# Altium schematic sheet bridge.SchDoc
size 431 x 279 mm; SheetNumber: 1; SheetTotal: 9
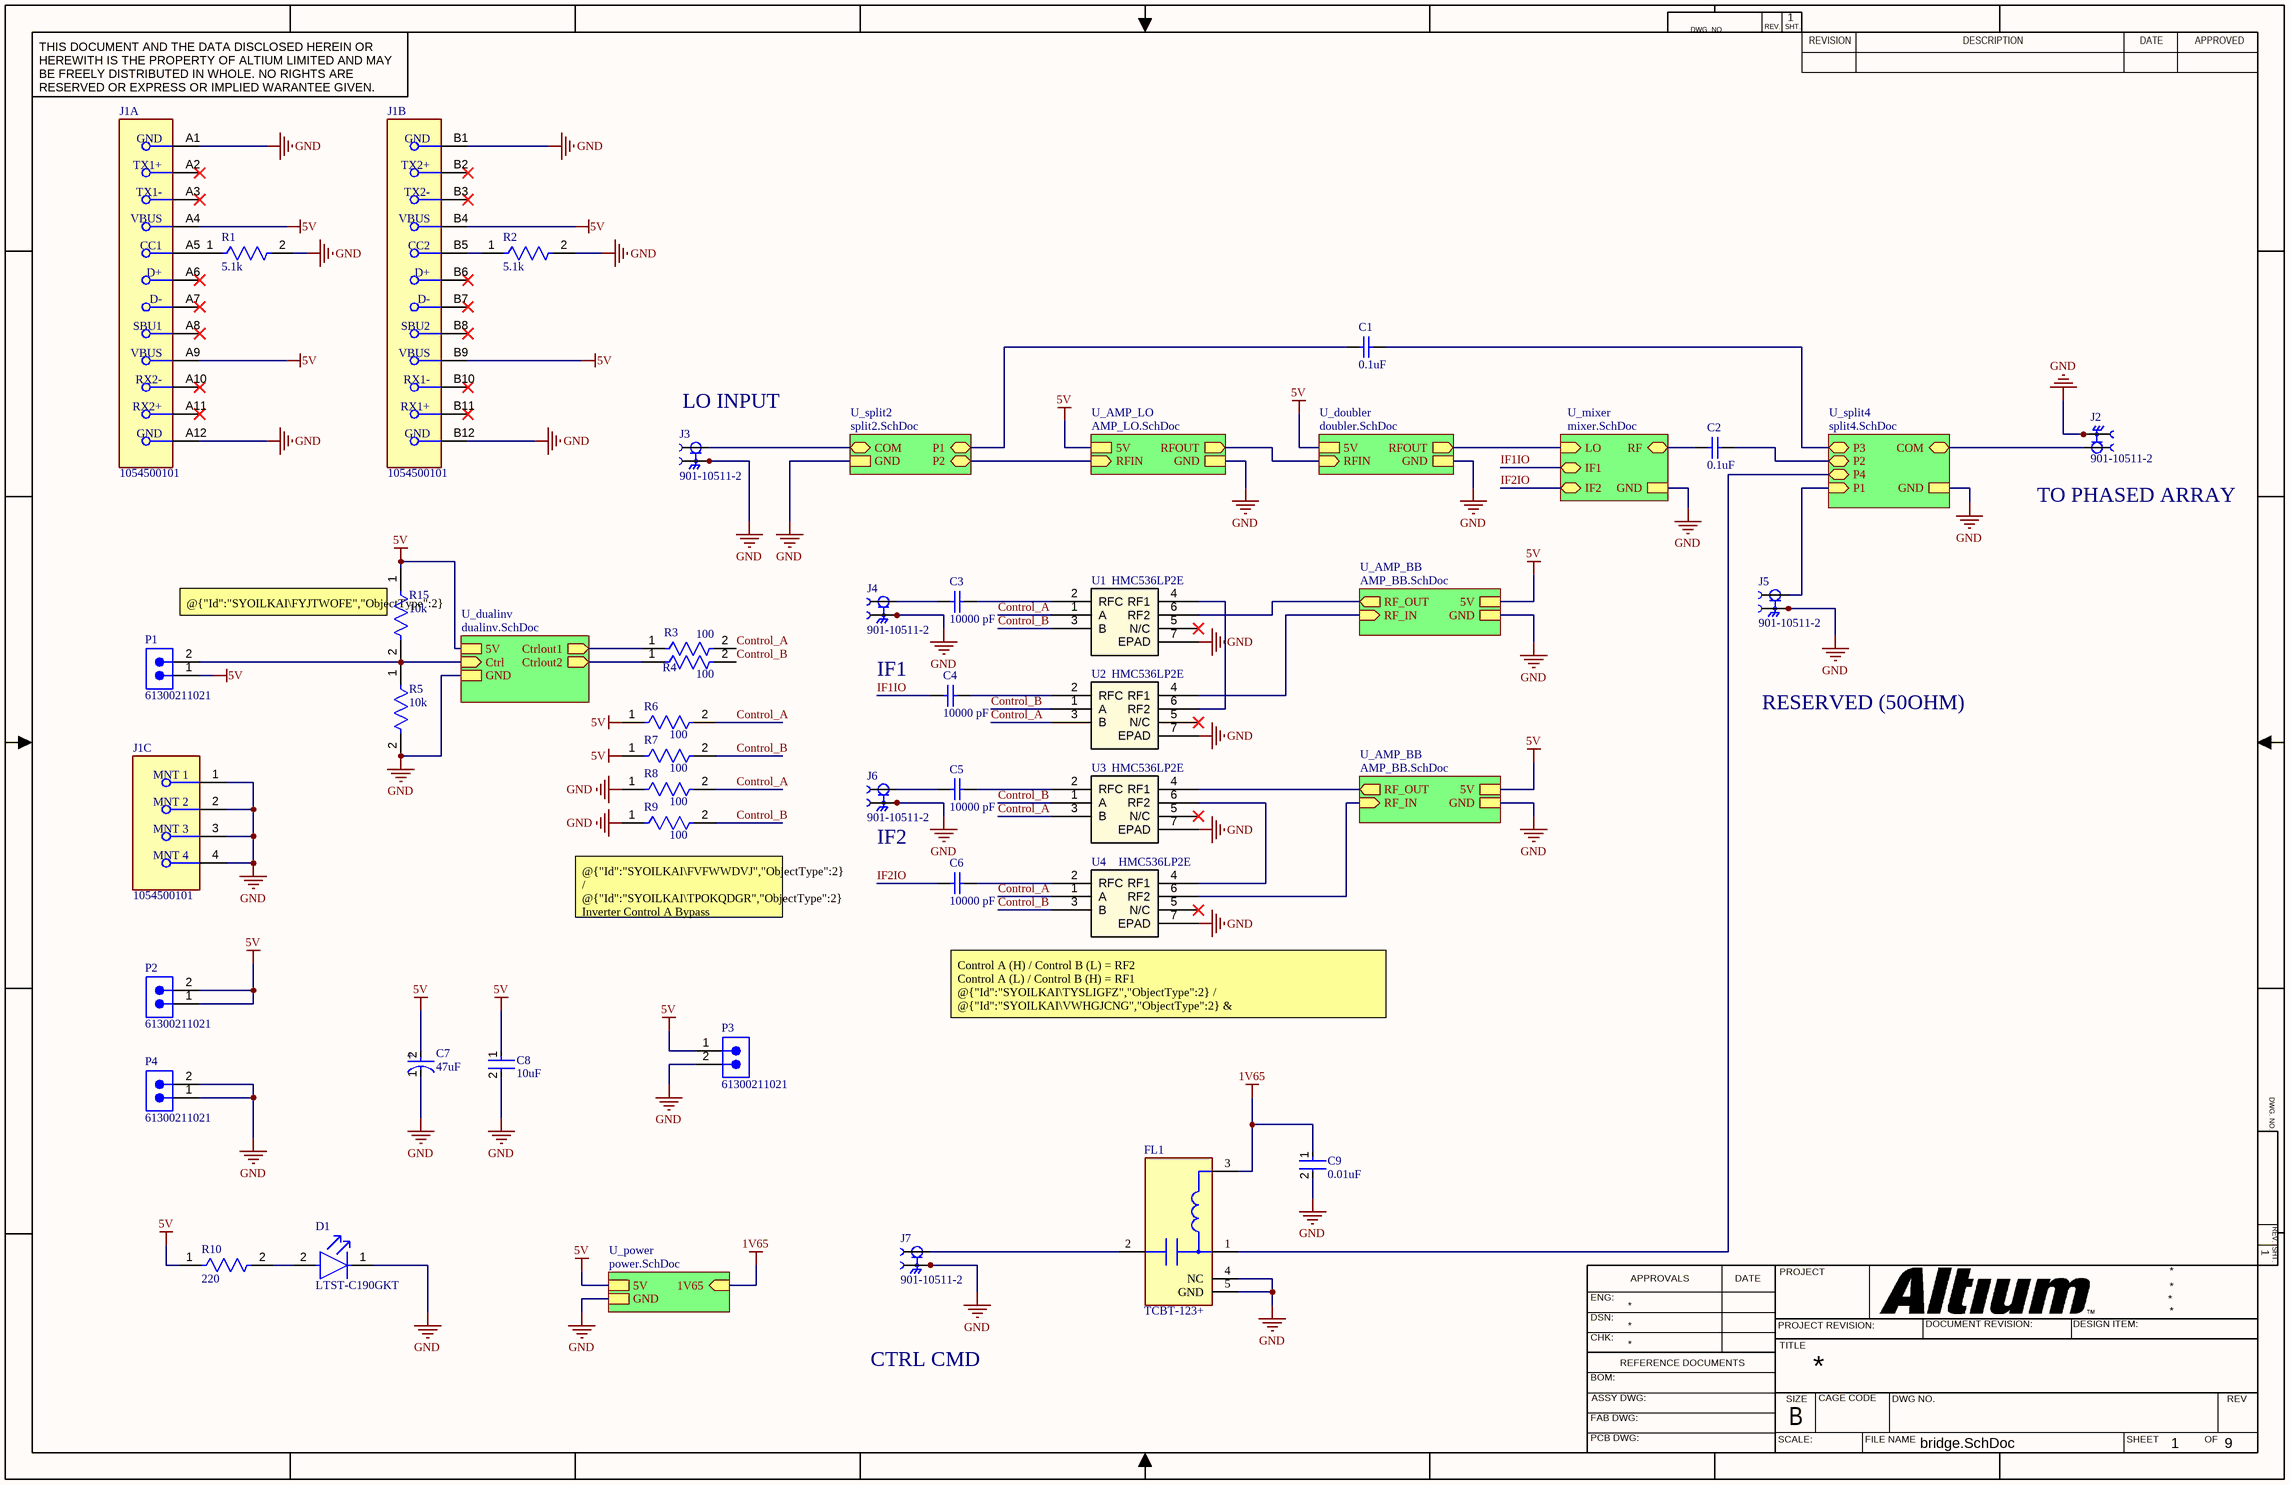
[diagram p0: bridge.SchDoc]

## Parts
C1  0.1uF  [CAPC0603X33X15LL03T05]
C2  0.1uF  [CAPC0603X33X15LL03T05]
C3  10000 pF  [CAPC1005X55X25ML05T10]
C4  10000 pF  [CAPC1005X55X25ML05T10]
C5  10000 pF  [CAPC1005X55X25ML05T10]
C6  10000 pF  [CAPC1005X55X25ML05T10]
C7  47uF  [FP-TAJB-MFG]
C8  10uF  [FP-ZRB18AR61E106ME01L-MFG]
C9  0.01uF  [FP-C0402-BB-MFG]
D1  LTST-C190GKT  [FP-LTST-C190GKT-MFG]
FL1  TCBT-123+  [FP-GU1414-MFG]
J1  1054500101  [FP-1054500101-MFG]  (parts A,B,C of 3)
J2  901-10511-2  [AMPHENOL_901-10511-2]
J3  901-10511-2  [AMPHENOL_901-10511-2]
J4  901-10511-2  [AMPHENOL_901-10511-2]
J5  901-10511-2  [AMPHENOL_901-10511-2]
J6  901-10511-2  [AMPHENOL_901-10511-2]
J7  901-10511-2  [AMPHENOL_901-10511-2]
P1  61300211021  [61300211021]
P2  61300211021  [61300211021]
P3  61300211021  [61300211021]
P4  61300211021  [61300211021]
R1  5.1k  [FP-CRCW0603-e3-IPC_C]
R2  5.1k  [FP-CRCW0603-e3-IPC_C]
R3  100  [FP-RC0603-0_55-MFG]
R4  100  [FP-RC0603-0_55-MFG]
R5  10k  [FP-RC0603-0_55-IPC_C]
R6  100  [FP-RC0603-0_55-MFG]
R7  100  [FP-RC0603-0_55-MFG]
R8  100  [FP-RC0603-0_55-MFG]
R9  100  [FP-RC0603-0_55-MFG]
R10  220  [FP-ERJ3G-MFG]
R15  10k  [FP-RC0603-0_55-IPC_C]
U1  HMC536LP2E  [HMC536LP2E]
U2  HMC536LP2E  [HMC536LP2E]
U3  HMC536LP2E  [HMC536LP2E]
U4  HMC536LP2E  [HMC536LP2E]

## Sub-sheets
U_AMP_BB = AMP_BB.SchDoc: RF_OUT (out), RF_IN (in), 5V, GND
U_AMP_BB = AMP_BB.SchDoc: RF_OUT (out), RF_IN (in), 5V, GND
U_AMP_LO = AMP_LO.SchDoc: GND, 5V, RFIN (in), RFOUT (out)
U_doubler = doubler.SchDoc: RFOUT (out), RFIN (in), GND, 5V
U_dualinv = dualinv.SchDoc: Ctrl (in), 5V, GND, Ctrlout1 (out), Ctrlout2 (out)
U_mixer = mixer.SchDoc: RF (bidir), GND, LO (in), IF1 (bidir), IF2 (bidir)
U_power = power.SchDoc: 5V, GND, 1V65 (in)
U_split2 = split2.SchDoc: COM (bidir), P1 (bidir), P2 (bidir), GND
U_split4 = split4.SchDoc: GND, P1 (in), P2 (bidir), P3 (bidir), P4 (bidir), COM (bidir)

## Nets
1V65: C9.1 FL1.3(DC) ; sheet U_power/1V65
5V: C7.2(A) C8.1 J1.A4(VBUS) J1.A9(VBUS) J1.B4(VBUS) J1.B9(VBUS) P1.1 P2.1 P2.2 P3.1 R6.1 R7.1 R10.1 R15.1 ; sheet U_AMP_LO/5V, sheet U_doubler/5V, sheet U_power/5V, sheet U_dualinv/5V, sheet U_AMP_BB/5V, sheet U_AMP_BB/5V
GND: C7.1(C) C8.2 C9.2 D1.1(C) FL1.4(NC) FL1.5(GND) J1.1(MNT_1) J1.2(MNT_2) J1.3(MNT_3) J1.4(MNT_4) J1.A1(GND) J1.A12(GND) J1.B1(GND) J1.B12(GND) J2.G1 J2.G2 J3.G1 J3.G2 J4.G1 J4.G2 J5.G1 J5.G2 J6.G1 J6.G2 J7.G1 J7.G2 P3.2 P4.1 P4.2 R1.2 R2.2 R5.2 R8.1 R9.1 U1.7(EPAD) U2.7(EPAD) U3.7(EPAD) U4.7(EPAD) ; sheet U_split2/GND, sheet U_mixer/GND, sheet U_split4/GND, sheet U_AMP_LO/GND, sheet U_doubler/GND, sheet U_power/GND, sheet U_dualinv/GND, sheet U_AMP_BB/GND, sheet U_AMP_BB/GND
Control_A: R3.2 R6.2 R8.2 U1.1(A) U2.3(B) U3.3(B) U4.1(A)
Control_B: R4.2 R7.2 R9.2 U1.3(B) U2.1(A) U3.1(A) U4.3(B)
IF1IO: C4.1 ; sheet U_mixer/IF1
IF2IO: C6.1 ; sheet U_mixer/IF2
NetC1_1: C1.1 ; sheet U_split2/P1
NetC1_2: C1.2 ; sheet U_split4/P3
NetC2_1: C2.1 ; sheet U_mixer/RF
NetC2_2: C2.2 ; sheet U_split4/P2
NetC3_1: C3.1 J4.1
NetC3_2: C3.2 U1.2(RFC)
NetC4_2: C4.2 U2.2(RFC)
NetC5_1: C5.1 J6.1
NetC5_2: C5.2 U3.2(RFC)
NetC6_2: C6.2 U4.2(RFC)
NetD1_2: D1.2(A) R10.2
NetFL1_1: FL1.1(RF&DC) ; sheet U_split4/P4
NetFL1_2: FL1.2(RF) J7.1
NetJ1_A5: J1.A5(CC1) R1.1
NetJ1_B5: J1.B5(CC2) R2.1
NetJ2_1: J2.1 ; sheet U_split4/COM
NetJ3_1: J3.1 ; sheet U_split2/COM
NetJ5_1: J5.1 ; sheet U_split4/P1
NetP1_2: P1.2 R5.1 R15.2 ; sheet U_dualinv/Ctrl
NetR3_1: R3.1 ; sheet U_dualinv/Ctrlout1
NetR4_1: R4.1 ; sheet U_dualinv/Ctrlout2
NetU1_4: U1.4(RF1) U2.6(RF2)
NetU1_6: U1.6(RF2) ; sheet U_AMP_BB/RF_OUT
NetU2_4: U2.4(RF1) ; sheet U_AMP_BB/RF_IN
NetU3_4: U3.4(RF1) ; sheet U_AMP_BB/RF_OUT
NetU3_6: U3.6(RF2) U4.4(RF1)
NetU4_6: U4.6(RF2) ; sheet U_AMP_BB/RF_IN
(unnamed): sheet U_split2/P2, sheet U_AMP_LO/RFIN
(unnamed): sheet U_mixer/LO, sheet U_doubler/RFOUT
(unnamed): sheet U_AMP_LO/RFOUT, sheet U_doubler/RFIN

Not connected (* = marked no-connect by the designer): J1 A2(TX1+)* A3(TX1-)* A6(D+)* A7(D-)* A8(SBU1)* A10(RX2-)* A11(RX2+)* B2(TX2+)* B3(TX2-)* B6(D+)* B7(D-)* B8(SBU2)* B10(RX1-)* B11(RX1+)*; U1 5(N/C)*; U2 5(N/C)*; U3 5(N/C)*; U4 5(N/C)*

## Notes on the sheet
- (near J3) LO INPUT
- (near J2) TO PHASED ARRAY
- (near R15) @{"Id":"SYOILKAI\FYJTWOFE","ObjectType":2} Pull-up DNI (Either @{"Id":"SYOILKAI\FYJTWOFE","ObjectType":2} | @{"Id":"SYOILKAI\KEMWNYXD","ObjectType":2} )
- IF1
- RESERVED (50OHM)
- (near J6) IF2
- (near R9) @{"Id":"SYOILKAI\FVFWWDVJ","ObjectType":2} / @{"Id":"SYOILKAI\TPOKQDGR","ObjectType":2} Inverter Control A Bypass
  @{"Id":"SYOILKAI\AHJBANLV","ObjectType":2} / @{"Id":"SYOILKAI\UMPLHLDU","ObjectType":2} Inverter Control B Bypass
  DNI Components.   Remove @{"Id":"SYOILKAI\ASZVIMTH","ObjectType":2} / @{"Id":"SYOILKAI\MEZSTMKU","ObjectType":2} to bypass
- (near U4) Control A (H) / Control B (L) = RF2
  Control A (L) / Control B (H) = RF1
  @{"Id":"SYOILKAI\TYSLIGFZ","ObjectType":2} / @{"Id":"SYOILKAI\VWHGJCNG","ObjectType":2} & @{"Id":"SYOILKAI\SXPUWDCE","ObjectType":2} / @{"Id":"SYOILKAI\PSJWTDBZ","ObjectType":2} Ctrl (L) --> Control A (H) / Control B (L) = AMP
  @{"Id":"SYOILKAI\TYSLIGFZ","ObjectType":2} / @{"Id":"SYOILKAI\VWHGJCNG","ObjectType":2} & @{"Id":"SYOILKAI\SXPUWDCE","ObjectType":2} / @{"Id":"SYOILKAI\PSJWTDBZ","ObjectType":2} Ctrl (H) --> Control A (L) / Control B (H) = Bypass
- CTRL CMD
- DWG. NO.
- REV.
- SHT.
- THIS DOCUMENT AND THE DATA DISCLOSED HEREIN OR HEREWITH IS THE PROPERTY OF ALTIUM LIMITED AND MAY BE FREELY DISTRIBUTED IN WHOLE. NO RIGHTS ARE RESERVED OR EXPRESS OR IMPLIED WARANTEE GIVEN.
- REVISION
- DESCRIPTION
- DATE
- APPROVED
- ENG:
- APPROVALS
- PROJECT
- DSN:
- CHK:
- REFERENCE DOCUMENTS
- PROJECT REVISION:
- TITLE
- DOCUMENT REVISION:
- DESIGN ITEM:
- BOM:
- FAB DWG:
- PCB DWG:
- ASSY DWG:
- SCALE:
- SIZE
- B
- CAGE CODE
- FILE NAME
- DWG NO.
- SHEET
- OF
- REV
- (in symbol CMP-04424-000629-1) +

## Library data of the parts
C1 C2 = CMP-2010-00245-1: CAP CER 0.1UF 16V X5R 0201, Broadband / Multilayer Capacitor; Manufacturer: KYOCERA AVX; Part Number: 531Z104KT16T; Supplier 1: Mouser; Supplier Part Number 1: 581-531Z104KT16T
C3-C6 = CNP-CAP-10000PF-RF: CAP CER 10000PF 16V X7R 0402, RF Series; Manufacturer: KYOCERA AVX; Part Number: 520L103KT16T; Supplier 1: Mouser; Supplier Part Number 1: 81-RDER72H473K2K1H3B
C7 = CMP-04424-000629-1: 47uF 10V  ±10% 1Ω 1210  SMD Tantalum Capacitor; Part Number: TAJB476K010RNJ; Manufacturer: KYOCERA AVX; Leakage Current: 4.7uA; ESR (Equivalent Series Resistance): 1R; Dissipation Factor: 8%; Polarity: Polar; Package Quantity: 1; Length: 3.5mm; Dielectric Material: Tantalum; Series: TAJ; Termination: SMD/SMT; Case Code (Metric): 3528; Case Code (Imperial): 1210; Height - Seated (Max): 0.083inch; Lead Pitch: 1.4mm; Features: General Purpose; Radiation Hardening: No; Lead Free: Lead Free; Construction: Flat; RoHS Compliant: Yes; Case/Package: 1210; Min Operating Temperature: -55°C; Voltage: 10V; Depth: 2.8mm; Mount: Surface Mount; REACH SVHC: No SVHC; Width: 0.11inch; Voltage Rating (DC): 10V; Max Operating Temperature: 125°C; Capacitance: 47uF; Tolerance: 10%; Voltage Rating: 10V; Packaging: Tape and Reel; Number of Pins: 2; Height: 1.9mm; Supplier 1: Future Electronics; Supplier Part Number 1: 7241805
C8 = CMP-06035-062385-2: CAP CER 10UF 25V X5R 0603; Part Number: ZRB18AR61E106ME01L; Manufacturer: Murata; Tolerance: 20%; Min Operating Temperature: -55°C; Voltage: 25V; Case Code (Imperial): 0603; Case Code (Metric): 1608; Voltage Rating (DC): 25V; Max Operating Temperature: 85°C; Depth: 0.8mm; Thickness: 0.047inch; RoHS Compliant: Yes; Dielectric: X5R; Mount: Surface Mount; Voltage Rating: 25V; Length: 0.063inch; Height: 1mm; Packaging: Cut Tape; Capacitance: 10uF; REACH SVHC: No SVHC; Width: 0.031inch; Case/Package: 0603; Supplier 1: Arrow Electronics; Supplier Part Number 1: ZRB18AR61E106ME01L
C9 = CMP-2008-02109-2: CAP CER 10000PF 50V X7R 0402; Manufacturer: Murata; Manufacturer Part Number: GCM155R71H103KA55D; Tolerance: 0.1; Value: 10,000 pF; Material: Ceramic; Height: 0.55mm; Temperature Range Low: -55°C; ComponentLink2URL: https://content.kemet.com/datasheets/KEM_C1002_X7R_SMD.pdf; Temperature Characteristic: X7R; Automotive: No; Device Class L2: Capacitors; ComponentLink2Description: Datasheet; Voltage Rating: 50 V; Capacitance: 10,000 pF; Temperature: -55°C to +125°C; Part Number: GCM155R71H103KA55D; Supplier 1: Arrow Electronics; Supplier Part Number 1: GCM155R71H103KA55D
D1 = CMP-22017-000005-2: LED GREEN CLEAR CHIP SMD; Manufacturer: Lite-On; Dominant Wavelength: 569nm; Reverse Voltage: 5V; Lens Color: Colorless; Viewing Angle: 130°; Voltage: 2V; Forward Current: 30mA; Power Dissipation: 100mW; Luminous Intensity: 6mcd; Number of LEDs: 1; Forward Voltage: 2.1V; Wavelength: 565nm; Test Current: 10mA; Min Operating Temperature: -55°C; Lens Style: Clear; Mount: Surface Mount; Width: 0.8mm; Packaging: Tape and Reel; Lens Transparency: Clear; Case Code (Metric): 1608; Depth: 0.8mm; Case Code (Imperial): 0603; Case/Package: 0603; Number of Pins: 2; Max Operating Temperature: 85°C; Lead Free: Lead Free; Number of Elements: 1; Length: 1.6mm; Height: 0.8mm; Package Quantity: 1; Power Rating: 100mW; Radiation Hardening: No; Illumination Color: Green; Color: Green; Part Number: LTST-C190GKT; Supplier 1: Digikey; Supplier Part Number 1: 160-1183-1-ND
FL1 = CMP-01968-107855816-1: TCBT-123+ OEMs, CMs ONLY (NO BROKERS), / BIAS TEE SMT, 10 MHZ - 12 GHZ, 5; Manufacturer: Mini-Circuits; Min Operating Temperature: -40°C; Height: 3.81mm; Max Operating Temperature: 85°C; Part Number: TCBT-123+
J1 = CMP-04767-000004-1: CONN RCP USB3.1 TYPEC 24P SMD RA; Manufacturer: Molex; Number Of Contacts: 24; Voltage Rating: 30V; Shielding: true; Is Female: yes; Current Rating: 0.25/1.25/5A; Pitch: 0.5mm; Conn Orientation: Right Angle; Package: 0; Height: 3.44mm; Footprint Url: https://www.molex.com/pdm_docs/sd/1054500101_sd.pdf; Device Class L1: Connectors; Category: Conn; Device Class L2: USB Connectors; Digikey Description: CONN RCP USB3.1 TYPEC 24P SMD RA; Contact Material: Gold,Nickel; Mouser Description: USB Shielded I/O Receptacle; Type C; Right Angle; Surface Mount; Gold over Nickel; ComponentLink2Description: Datasheet; Lead Free: Yes; Automotive: No; Temperature Range High: +85°C; RoHS: TRUE; ComponentLink2URL: https://www.molex.com/webdocs/datasheets/pdf/en-us/1054500101_IO_CONNECTORS.pdf; Temperature: -30°C to +85°C; Usb Standard: USB 3.1; Temperature Range Low: -30°C; Manufacturer Part Number: 1054500101; Part Number: 1054500101; Supplier 1: Arrow Electronics; Supplier Part Number 1: 105450-0101
J2-J7 = 901-10511-2: SMA Straight End Launch Jack, .010 Pin, .068  PCB, Edge-Mount, High Frequency | Amphenol RF 901-10511-2; Manufacturer: Amphenol RF; Part Number: 901-10511-2; Supplier 1: Avnet; Supplier Part Number 1: 99Y7069
P1-P4 = CMP-1502-01059-3: CONN HEADER R/A 2POS 2.54MM; NexarPartId: 32855519; Manufacturer: Wurth; Gender: Male; Contact Resistance: 20mΩ; Operating Supply Voltage: 250V; Connector Type: Male Pin; Current Rating: 3A; Number of Contacts: 2; Termination: Solder; Number of Pins: 2; Number of Rows: 1; Contact Plating: Gold; Contact Material: Copper; REACH SVHC: Unknown; Mount: Through Hole; RoHS: Compliant; Color: Black; Packaging: Bulk; Pitch: 2.54mm; Contact Mating Length: 5.9944mm; Number of Positions: 2; Lead Pitch: 2.54mm; Part Number: 61300211021; Supplier 1: Digikey; Supplier Part Number 1: 732-5335-ND
R1 R2 = CMP-1012-00590-3: RES Thick Film, 5.1kΩ, 1%, 0.1W, 100ppm/°C, 0603; Part Number: ERJ-3EKF5101V; Manufacturer: Panasonic; Power Rating: 100mW; Voltage Rating (DC): 75V; Resistance: 5.1kR; Width: 0.85mm; Depth: 0.85mm; Military Standard: Not; Package Quantity: 5000; Case Code (Metric): 1608; Length: 1.55mm; Weight: 7.1E-05oz; Packaging: Tape and Reel; Temperature Coefficient: 100ppm/°C; Case Code (Imperial): 0603; Lead Free: Lead Free; Radiation Hardening: No; Contact Plating: Tin; Composition: Thick Film; Max Operating Temperature: 155°C; Termination: SMD/SMT; Case/Package: 0603; Min Operating Temperature: -55°C; Tolerance: 1%; Voltage Rating: 75V; Mount: Surface Mount; Height: 0.45mm; Supplier 1: Mouser; Supplier Part Number 1: 667-ERJ-3EKF5101V
R3 R4 R6-R9 = CMP-2000-05021-2: RES SMD 100 OHM 5% 1/10W 0603; Manufacturer: Panasonic; Part Number: ERJ-3GEYJ101V; Temperature Coefficient: 100ppm/°C; Voltage Rating (DC): 50V; Power Rating: 100mW; Resistance: 100R; Features: Moisture Resistant; Width: 0.8mm; RoHS Compliant: Yes; Series: RC; Case Code (Metric): 1608; Packaging: Tape and Reel; Construction: Rectangular; Contact Plating: Tin; Resistor Type: Thick Film; Case/Package: 0603; Military Standard: Not; Case Code (Imperial): 0603; Number of Pins: 2; Length: 1.6mm; Size Code: 0603; Voltage Rating: 50V; Min Operating Temperature: -55°C; Max Power Dissipation: 100mW; Tolerance: 5%; Lead Free: Lead Free; Termination: SMD/SMT; Resistance Tolerance: 5%; Depth: 0.8mm; Max Operating Temperature: 155°C; Number of Terminations: 2; Radiation Hardening: No; Supplier 1: Mouser; Supplier Part Number 1: 667-ERJ-3GEYJ101V
R5 R15 = CMP-2100-03664-2: RES 10K OHM 1% 1/10W 0603; Part Number: ERJ-S03F1002V; Manufacturer: Panasonic; Voltage Rating: 75V; Voltage Rating (DC): 50V; Resistance: 10kR; Power Rating: 100mW; Temperature Coefficient: 100ppm/°C; Depth: 0.8mm; Termination: SMD/SMT; Resistor Type: Thick Film; Series: RC; Construction: Rectangular; Features: Moisture Resistant; Packaging: Tape and Reel; Min Operating Temperature: -55°C; Number of Terminations: 2; Lead Pitch: 0.3mm; RoHS Compliant: Yes; Case/Package: 0603; Resistance Tolerance: 1%; Military Standard: Not; Weight: 7.1E-05oz; Number of Pins: 2; Tolerance: 1%; Length: 1.6mm; Case Code (Imperial): 0603; Lead Free: Lead Free; Width: 0.8mm; Max Power Dissipation: 100mW; Height: 0.45mm; Max Operating Temperature: 155°C; Case Code (Metric): 1608; Size Code: 0603; Supplier 1: Mouser; Supplier Part Number 1: 667-ERJ-S03F1002V
R10 = CMP-2000-00746-2: RES SMD 220 OHM 5% 1/10W 0603; Manufacturer: Panasonic; Part Number: ERJ-3GEYJ221V; Max Power Dissipation: 100mW; Voltage Rating (DC): 50V; Temperature Coefficient: 200ppm/°C; Voltage Rating: 75V; Resistance: 220R; Height: 0.45mm; Case Code (Metric): 1608; Mount: Surface Mount; Military Standard: Not; Contact Plating: Tin; Radiation Hardening: No; Technology: THICK FILM; Case Code (Imperial): 0603; Features: Automotive AEC-Q200; Tolerance: 5%; Lead Free: Lead Free; Width: 0.031inch; Weight: 7.1E-05oz; Max Operating Temperature: 155°C; Case/Package: 0603; Series: ERJ; Package Quantity: 1; Number of Terminations: 2; Construction: Rectangular; Packaging: Tape and Reel; REACH SVHC: No SVHC; Min Operating Temperature: -55°C; Resistor Type: Thick Film; Length: 1.6mm; Power Rating: 100mW; Depth: 0.8mm; Resistance Tolerance: 5%; Termination: SMD/SMT; RoHS Compliant: Yes; Supplier 1: Future Electronics; Supplier Part Number 1: 4042422
U1-U4 = HMC536LP2E: IC RF SWITCH SPDT 6GHZ 6DFN; Manufacturer: Analog Devices; Part Number: HMC536LP2E; Supplier 1: Mouser; Supplier Part Number 1: 584-HMC536LP2E